# EAGLE schematic clock_module (EAGLE 9.6.0)
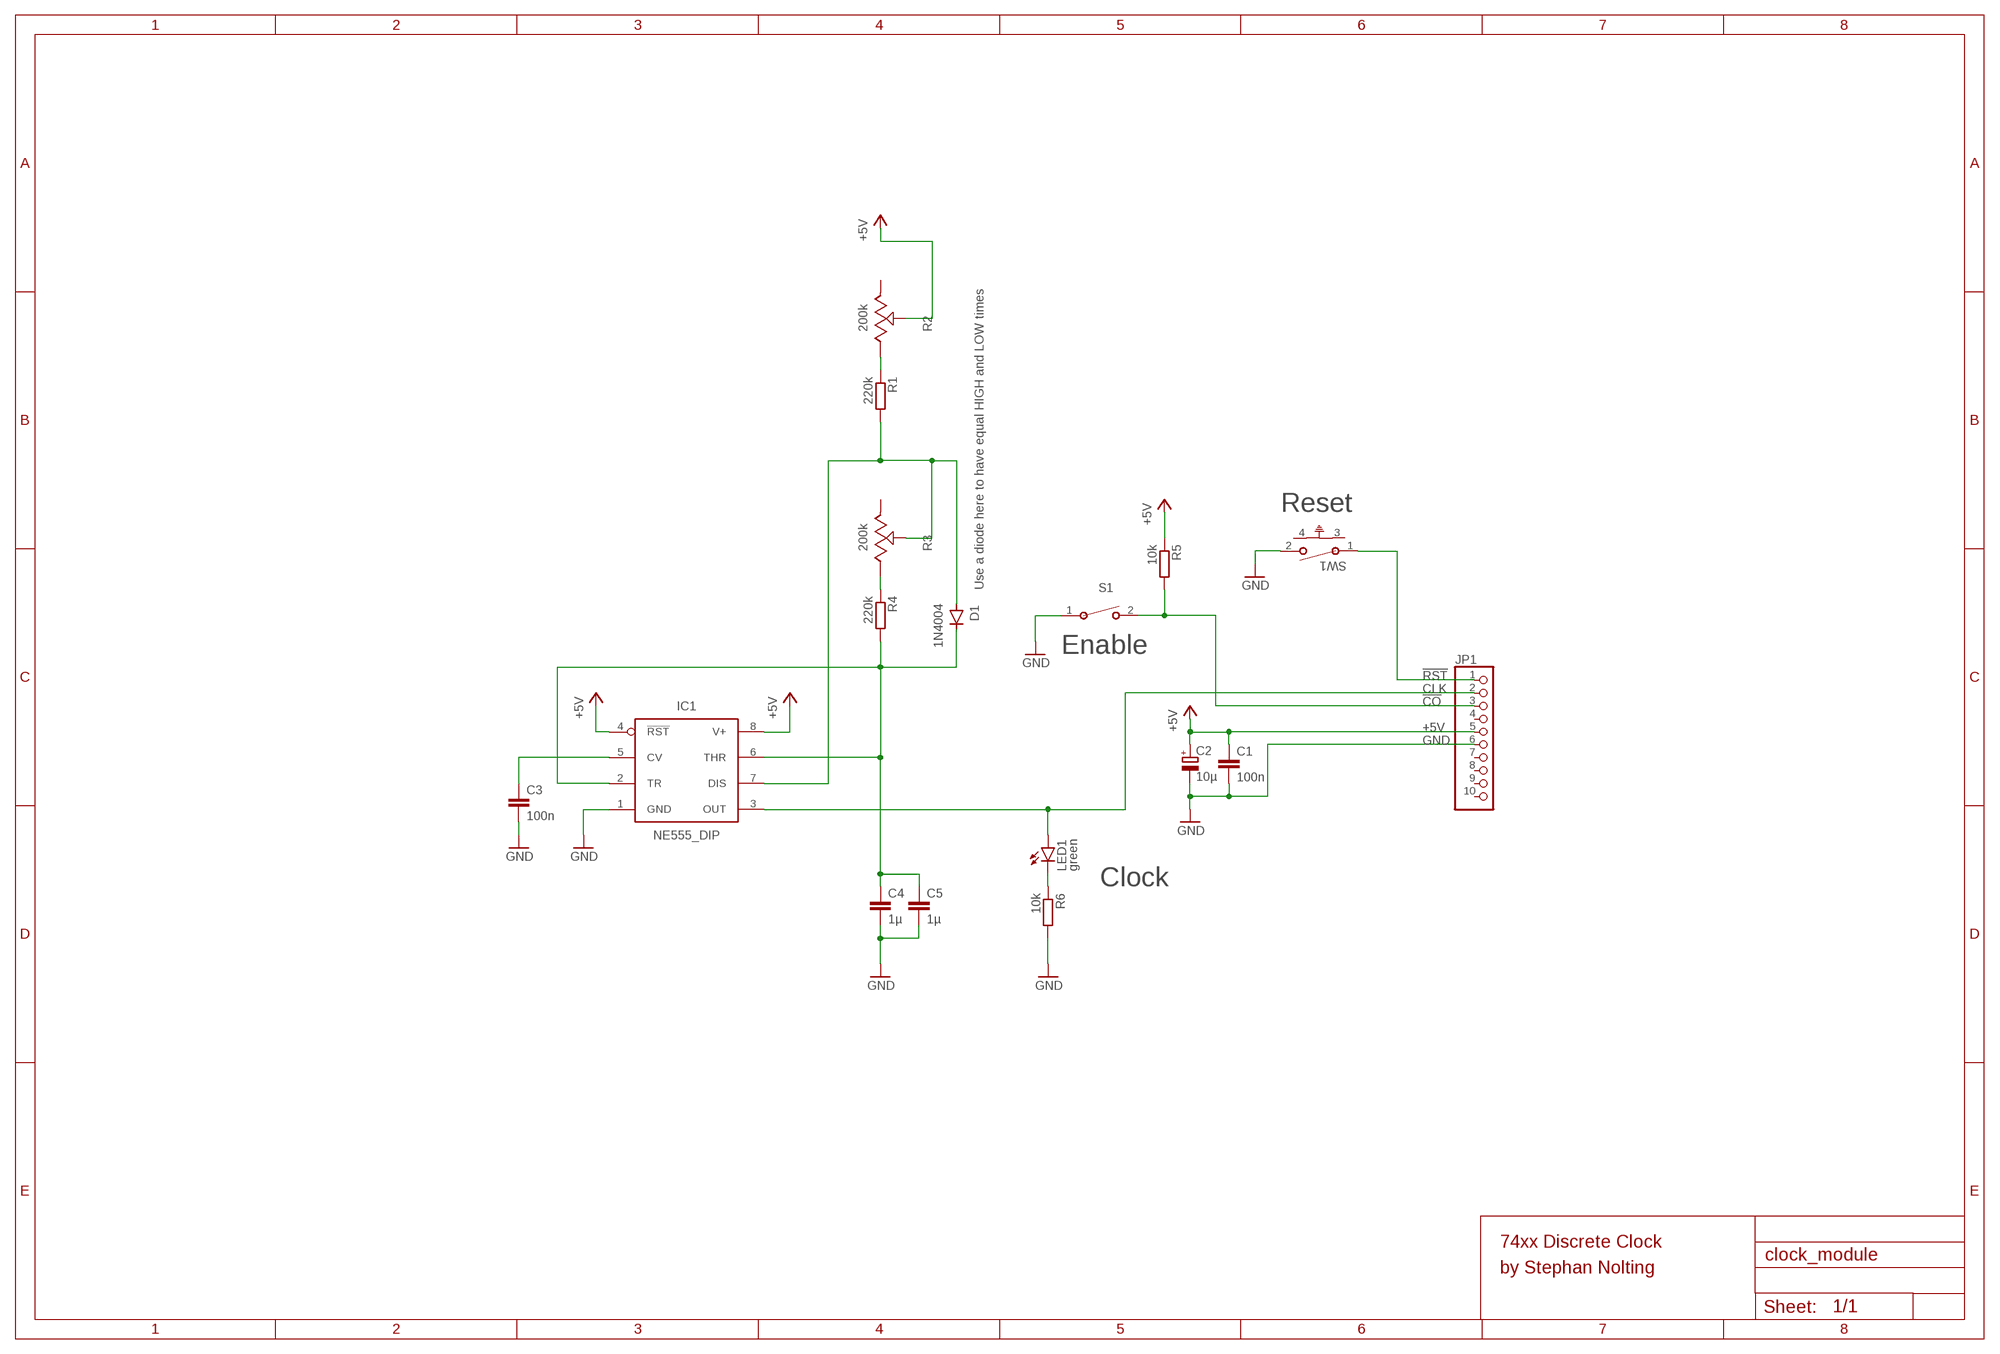
[diagram p0: schematic, sheet 1]

## Parts
C1  100n  C-EU025-024X044  [C025-024X044]
C2  10µ  CPOL-EUE2-5  [E2-5]
C3  100n  C-EU025-024X044  [C025-024X044]
C4  1µ  C-EU025-024X044  [C025-024X044]
C5  1µ  C-EU025-024X044  [C025-024X044]
D1  1N4004  [DO-41]
IC1  NE555_DIP  [DIP826W53P254L959H508Q8B]
JP1  PINHD-1X10/90  [1X10/90]
LED1  green  LED3MM  [LED3MM]
R1  220k  R-EU_0204/7  [0204/7]
R2  200k  3310Y-001-104L  [3310Y-001-104L-ND]
R3  200k  3310Y-001-104L  [3310Y-001-104L-ND]
R4  220k  R-EU_0204/7  [0204/7]
R5  10k  R-EU_0204/7  [0204/7]
R6  10k  R-EU_0204/7  [0204/7]
S1  1825966-1  [SWDIP2_256X170P100]
SW1  1-1825027-4  [SW2_1825027-E]

## Nets
!CO: JP1.3 R5.2 S1.2
!RST: JP1.1 SW1.1
+5V: C1.1 C2.+ IC1.4(!RST) IC1.8(V+) JP1.5 R2.2 R5.1
CLK: IC1.3(OUT) JP1.2 LED1.A
GND: C1.2 C2.- C3.2 C4.2 C5.2 IC1.1(GND) JP1.6 R6.2 S1.1 SW1.2
N$1: C3.1 IC1.5(CV)
N$2: R3.3 R4.1
N$3: C4.1 C5.1 D1.C IC1.2(TR) IC1.6(THR) R4.2
N$4: R1.1 R2.3
N$5: D1.A IC1.7(DIS) R1.2 R3.2
N$6: LED1.K(C) R6.1
Unconnected: JP1.4 JP1.7 JP1.8 JP1.9 JP1.10 R2.1 R3.1 SW1.3 SW1.4

## Notes on the sheet
- Reset
- Use a diode here to have equal HIGH and LOW times
- Enable
- Clock
- 74xx Discrete Clock
- by Stephan Nolting

## Library data of the parts
C1 C3-C5 = rcl:C-EU: CAPACITOR, European symbol; SPICEPREFIX: C
C2 = rcl:CPOL-EU: POLARIZED CAPACITOR, European symbol; SPICEPREFIX: C
D1 = Diodes:1N4004: DIODE GEN PURP 400V 1A DO41 Manufacturer's datasheet <https://www.mccsemi.com/pdf/Products/1N4001-1N4007(DO-41).pdf>; CREATED_BY: PCBLayout.com; DIGIKEY_PART_NUMBER: 1N4004MSCT-ND; MANUFACTURER: Micro Commercial Co; MPN: 1N4004; PACKAGE: DO-41
IC1 = IC_Clock-Timing:*555: TIMER 555 General purpose precision timers NE555 : Texas Datasheet <http://www.ti.com/general/docs/suppproductinfo.tsp?distId=10&gotoUrl=http%3A%2F%2Fwww.ti.com%2Flit%2Fgpn%2Fne555>, Diodes Incorporated Datasheet <https://www.diodes.com/assets/Datasheets/NE555_SA555_NA555.pdf> LM555 Datasheet <http://www.ti.com/general/docs/suppproductinfo.tsp?distId=10&gotoUrl=http%3A%2F%2Fwww.ti.com%2Flit%2Fgpn%2Flm555> LMC555 Datasheet <http://www.ti.com/general/docs/suppproductinfo.tsp?distId=10&gotoUrl=http%3A%2F%2Fwww.ti.com%2Flit%2Fgpn%2Flmc555> ICM7555 : Maxim Integrated Datasheet <https://datasheets.maximintegrated.com/en/ds/ICM7555-ICM7556.pdf>, Renesas Electronics America Inc Datasheet <https://www.renesas.com/en-us/www/doc/datasheet/icm7555-56.pdf>; CATEGORY: IC_Clock-Timing; CURRENT-SUPPLY: 10mA; DESCRIPTION: IC OSC SINGLE TIMER 100KHZ 8-DIP; FREQUENCY: 100kHz; MANUFACTURER: Texas Instruments; MPN: NE555P; OPERATING_TEMP: 0°C to 70°C; PART_STATUS: Active; ROHS_COMPLIANT: ROHS3 Compliant; SUB-CATEGORY: Timer
JP1 = pinhead:PINHD-1X10: PIN HEADER
LED1 = led:LED: LED OSRAM: - CHIPLED LG R971, LG N971, LY N971, LG Q971, LY Q971, LO R971, LY R971 LH N974, LH R974 LS Q976, LO Q976, LY Q976 LO Q996 - Hyper CHIPLED LW Q18S LB Q993, LB Q99A, LB R99A - SideLED LS A670, LO A670, LY A670, LG A670, LP A670 LB A673, LV A673, LT A673, LW A673 LH A674 LY A675 LS A676, LA A676, LO A676, LY A676, LW A676 LS A679, LY A679, LG A679 - Hyper Micro SIDELED® LS Y876, LA Y876, LO Y876, LY Y876 LT Y87S - SmartLED LW L88C, LW L88S LB L89C, LB L89S, LG L890 LS L89K, LO L89K, LY L89K LS L896, LA L896, LO L896, LY L896 - TOPLED LS T670, LO T670, LY T670, LG T670, LP T670 LSG T670, LSP T670, LSY T670, LOP T670, LYG T670 LG T671, LOG T671, LSG T671 LB T673, LV T673, LT T673, LW T673 LH T674 LS T676, LA T676, LO T676, LY T676, LB T676, LH T676, LSB T676, LW T676 LB T67C, LV T67C, LT T67C, LS T67K, LO T67K, LY T67K, LW E67C LS E67B, LA E67B, LO E67B, LY E67B, LB E67C, LV E67C, LT E67C LW T67C LS T679, LY T679, LG T679 LS T770, LO T770, LY T770, LG T770, LP T770 LB T773, LV T773, LT T773, LW T773 LH T774 LS E675, LA E675, LY E675, LS T675 LS T776, LA T776, LO T776, LY T776, LB T776 LHGB T686 LT T68C, LB T68C - Hyper Mini TOPLED® LB M676 - Mini TOPLED Santana® LG M470 LS M47K, LO M47K, LY M47K Source: http://www.osram.convergy.de LUXEON: - LUMILED® LXK2-PW12-R00, LXK2-PW12-S00, LXK2-PW14-U00, LXK2-PW14-V00 LXK2-PM12-R00, LXK2-PM12-S00, LXK2-PM14-U00 LXK2-PE12-Q00, LXK2-PE12-R00, LXK2-PE12-S00, LXK2-PE14-T00, LXK2-PE14-U00 LXK2-PB12-K00, LXK2-PB12-L00, LXK2-PB12-M00, LXK2-PB14-N00, LXK2-PB14-P00, LXK2-PB14-Q00 LXK2-PR12-L00, LXK2-PR12-M00, LXK2-PR14-Q00, LXK2-PR14-R00 LXK2-PD12-Q00, LXK2-PD12-R00, LXK2-PD12-S00 LXK2-PH12-R00, LXK2-PH12-S00 LXK2-PL12-P00, LXK2-PL12-Q00, LXK2-PL12-R00 Source: www.luxeon.com KINGBRIGHT: KA-3528ASYC Source: www.kingbright.com
R1 R4-R6 = rcl:R-EU_: RESISTOR, European symbol; SPICEPREFIX: R
R2 R3 = Potentiometer_Trimmers:3310Y-001-104L: POT 100K OHM 1/4W PLASTIC LINEAR Manufacturer's datasheet <https://www.bourns.com/docs/Product-Datasheets/3310.pdf>; CREATED_BY: PCBLayout.com; DIGIKEY_PARTNO: 3310Y-001-104L-ND; MANUFACTURER: Bourns Inc.; MPN: 3310Y-001-104L
S1 = Switches:1825966-1; BUILT_BY: EMA_UL_Team; CATEGORY: Tactile Switches; COPYRIGHT: Copyright (C) 2016 Accelerated Designs. All rights reserved; DESCRIPTION: FSMCH=3.5 X 6.0 X 4.3 TACT SWITCH, HT; MANUFACTURER_PART_NUMBER: 1825966-1; PART_STATUS: active; SERIES: Unknown; VENDOR: TE Connectivity
SW1 = Switches:1-1825027-4; BUILT_BY: EMA_UL_Team; CATEGORY: Tactile Switches; CONFIGURATION__POLE-THROW_: Single Pole - Single Throw; CONTACT_CURRENT_RATING: 50; COPYRIGHT: Copyright (C) 2016 Accelerated Designs. All rights reserved; DESCRIPTION: FSMRA5JH04=R/A,TACT PB SW,160G; MANUFACTURER_PART_NUMBER: 1-1825027-4; MAX_SWITCHING_CURRENT: -; MAX_SWITCHING_VOLTAGE_AC_: -; PART_STATUS: active; PRODUCT_TYPE: Switch; SERIES: Unknown; SWITCH_TYPE: Tactile Switches; TE_INTERNAL_NUMBER: 1-1825027-4; TE_PART_NUMBER: 1-1825027-4; VENDOR: TE Connectivity; VOLTAGE_RATING: -